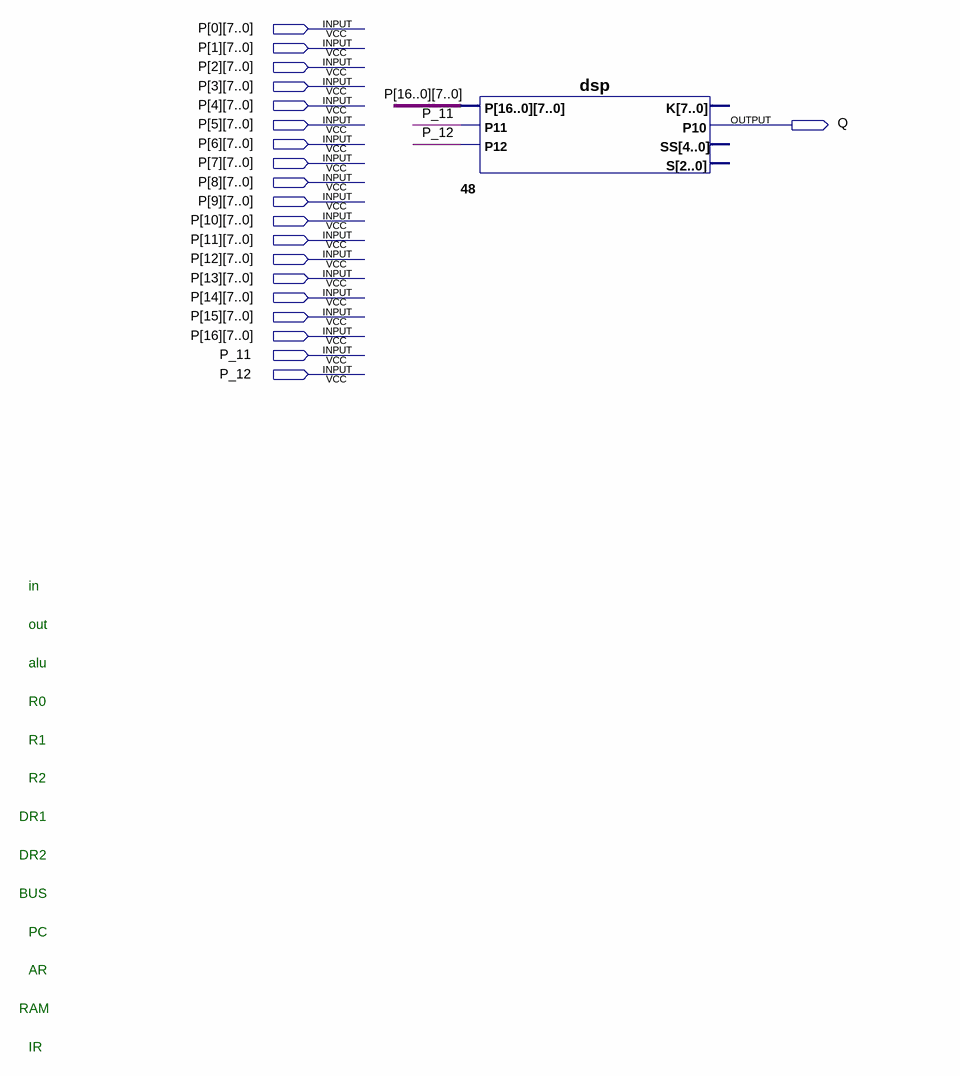
[diagram p0: schematic sheet]
// Quartus schematic dsplay.bdf as structural Verilog: 1 symbols, 20 pins
module dsplay (
  input  [7:0] P_0,
  input  [7:0] P_1,
  input  [7:0] P_2,
  input  [7:0] P_3,
  input  [7:0] P_4,
  input  [7:0] P_5,
  input  [7:0] P_6,
  input  [7:0] P_7,
  input  [7:0] P_8,
  input  [7:0] P_9,
  input  [7:0] P_10,
  input  [7:0] P_11,
  input  [7:0] P_12,
  input  [7:0] P_13,
  input  [7:0] P_14,
  input  [7:0] P_15,
  input  [7:0] P_16,
  input  P_11_1bit,
  input  P_12_1bit,
  output Q
);

  dsp u_48 (
    .P({P_16, P_15, P_14, P_13, P_12, P_11, P_10, P_9, P_8, P_7, P_6, P_5, P_4, P_3, P_2, P_1, P_0}),
    .P11(P_11_1bit), .P12(P_12_1bit), .P10(Q));  // open: K, SS, S

  // Notes on the sheet:
  //   in
  //   out
  //   alu
  //   R0
  //   R1
  //   R2
  //   DR1
  //   DR2
  //   BUS
  //   PC
  //   AR
  //   RAM
  //   IR
endmodule
